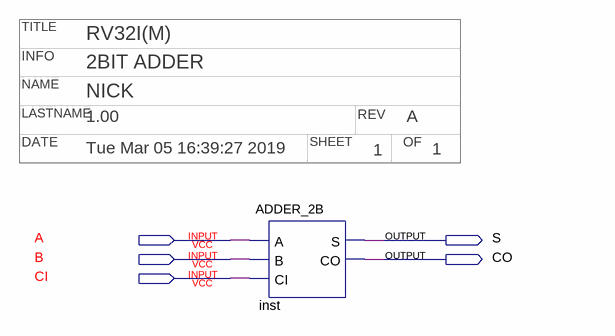
[diagram p0: schematic sheet]
// Quartus schematic ADDER_2BTEST.bdf as structural Verilog: 1 symbols, 5 pins
// Title block: TITLE: RV32I(M); INFO: 2BIT ADDER; NAME: NICK; LASTNAME: 1.00; REV: A; DATE: Tue Mar 05 16:39:27 2019; SHEET: 1; OF: 1
module ADDER_2BTEST (
  input  A,
  input  B,
  input  CI,
  output S,
  output CO
);

  ADDER_2B inst (.A(A), .B(B), .CI(CI), .S(S), .CO(CO));
endmodule
